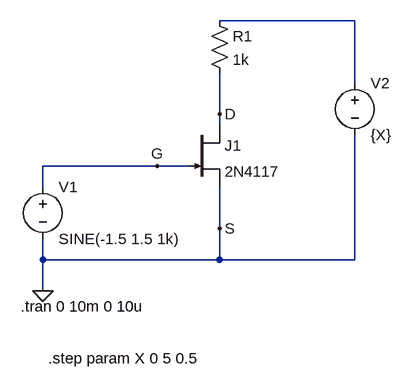
[diagram p0: schematic jfet.asc]
jfet.asc, the LTspice schematic file:
Version 4
SHEET 1 880 680
WIRE 416 -64 208 -64
WIRE 416 32 416 -64
WIRE 208 80 208 16
WIRE 208 96 208 80
WIRE 112 160 -64 160
WIRE 160 160 112 160
WIRE -64 192 -64 160
WIRE 208 256 208 192
WIRE -64 304 -64 272
WIRE 208 304 208 256
WIRE 208 304 -64 304
WIRE 416 304 416 112
WIRE 416 304 208 304
WIRE -64 352 -64 304
FLAG -64 352 0
FLAG 208 80 D
FLAG 208 256 S
FLAG 112 160 G
SYMBOL njf 160 96 R0
SYMATTR InstName J1
SYMATTR Value 2N4117
SYMBOL voltage -64 176 R0
WINDOW 123 0 0 Left 2
WINDOW 39 0 0 Left 2
SYMATTR InstName V1
SYMATTR Value SINE(-1.5 1.5 1k)
SYMBOL res 192 -80 R0
SYMATTR InstName R1
SYMATTR Value 1k
SYMBOL voltage 416 16 R0
WINDOW 123 0 0 Left 2
WINDOW 39 0 0 Left 2
SYMATTR InstName V2
SYMATTR Value {X}
TEXT -98 376 Left 2 !.tran 0 10m 0 10u
TEXT -56 456 Left 2 !.step param X 0 5 0.5

The netlist it stands for:
* jfet.asc
J1 D G 0 2N4117
V1 G 0 SINE(-1.5 1.5 1k)
R1 N001 D 1k
V2 N001 0 {X}
.model NJF NJF
.model PJF PJF
.lib standard.jft
.tran 0 10m 0 10u
.step param X 0 5 0.5
.backanno
.end